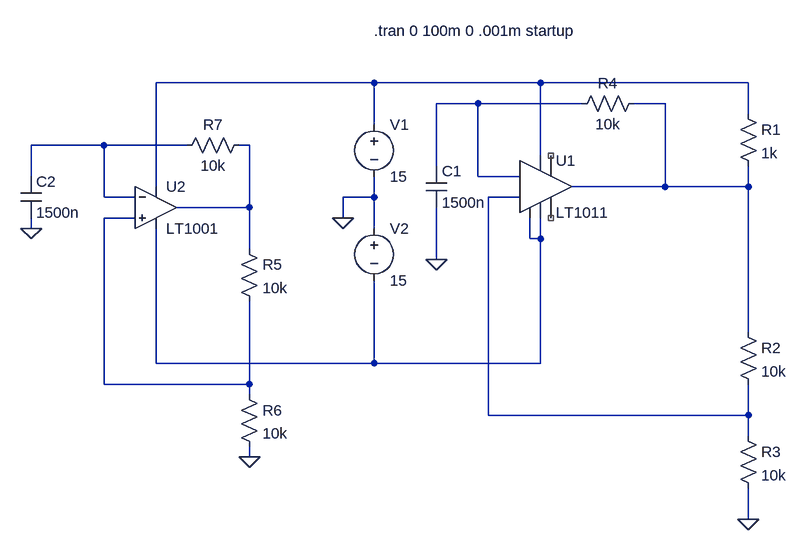
[diagram p0: schematic comparadorLt1011 2.asc]
comparadorLt1011 2.asc, the LTspice schematic file:
Version 4
SHEET 1 880 820
WIRE -64 0 -400 0
WIRE 192 0 -64 0
WIRE 512 0 192 0
WIRE 96 32 32 32
WIRE 256 32 96 32
WIRE 384 32 336 32
WIRE 512 48 512 0
WIRE -64 64 -64 0
WIRE -480 96 -592 96
WIRE -352 96 -480 96
WIRE -256 96 -272 96
WIRE 192 112 192 0
WIRE 32 128 32 32
WIRE -592 144 -592 96
WIRE 96 144 96 32
WIRE 160 144 96 144
WIRE -400 160 -400 0
WIRE 384 160 384 32
WIRE 384 160 240 160
WIRE 512 160 512 128
WIRE 512 160 384 160
WIRE -480 176 -480 96
WIRE -432 176 -480 176
WIRE -64 176 -64 144
WIRE -64 176 -112 176
WIRE 160 176 112 176
WIRE -256 192 -256 96
WIRE -256 192 -368 192
WIRE -432 208 -480 208
WIRE -112 208 -112 176
WIRE -592 224 -592 208
WIRE -64 224 -64 176
WIRE 176 240 176 208
WIRE 192 240 192 208
WIRE 192 240 176 240
WIRE -256 256 -256 192
WIRE 32 272 32 192
WIRE 512 384 512 160
WIRE -400 432 -400 224
WIRE -64 432 -64 304
WIRE -64 432 -400 432
WIRE 192 432 192 240
WIRE 192 432 -64 432
WIRE -480 464 -480 208
WIRE -256 464 -256 336
WIRE -256 464 -480 464
WIRE -256 480 -256 464
WIRE 112 512 112 176
WIRE 512 512 512 464
WIRE 512 512 112 512
WIRE 512 544 512 512
WIRE -256 576 -256 560
WIRE 512 672 512 624
FLAG -112 208 0
FLAG 32 272 0
FLAG 512 672 0
FLAG -256 576 0
FLAG -592 224 0
SYMBOL Comparators\\LT1011 192 160 R0
SYMATTR InstName U1
SYMBOL voltage -64 48 R0
WINDOW 123 0 0 Left 0
WINDOW 39 0 0 Left 0
SYMATTR InstName V1
SYMATTR Value 15
SYMBOL voltage -64 208 R0
WINDOW 123 0 0 Left 0
WINDOW 39 0 0 Left 0
SYMATTR InstName V2
SYMATTR Value 15
SYMBOL res 496 32 R0
SYMATTR InstName R1
SYMATTR Value 1k
SYMBOL res 496 368 R0
SYMATTR InstName R2
SYMATTR Value 10k
SYMBOL res 496 528 R0
SYMATTR InstName R3
SYMATTR Value 10k
SYMBOL res 352 16 R90
WINDOW 0 0 56 VBottom 2
WINDOW 3 32 56 VTop 2
SYMATTR InstName R4
SYMATTR Value 10k
SYMBOL cap 16 128 R0
SYMATTR InstName C1
SYMATTR Value 1500n
SYMBOL OpAmps\\LT1001 -400 128 R0
SYMATTR InstName U2
SYMBOL res -272 240 R0
SYMATTR InstName R5
SYMATTR Value 10k
SYMBOL res -272 464 R0
SYMATTR InstName R6
SYMATTR Value 10k
SYMBOL res -256 80 R90
WINDOW 0 0 56 VBottom 2
WINDOW 3 32 56 VTop 2
SYMATTR InstName R7
SYMATTR Value 10k
SYMBOL cap -608 144 R0
SYMATTR InstName C2
SYMATTR Value 1500n
TEXT -64 -80 Left 2 !.tran 0 100m 0 .001m startup

The netlist it stands for:
* comparadorLt1011 2.asc
XU1 N008 N006 N002 N008 NC_01 NC_02 N003 N001 LT1011
V1 N001 0 15
V2 0 N008 15
R1 N001 N003 1k
R2 N003 N006 10k
R3 N006 0 10k
R4 N003 N002 10k
C1 N002 0 1500n
XU2 N007 N004 N001 N008 N005 LT1001  ; pins In+ In- V+ V- OUT
R5 N005 N007 10k
R6 N007 0 10k
R7 N005 N004 10k
C2 N004 0 1500n
.tran 0 100m 0 .001m startup
.lib LTC1.lib
.lib LTC.lib
.backanno
.end